# Altium project QUTMS-TSAL.PrjPcb
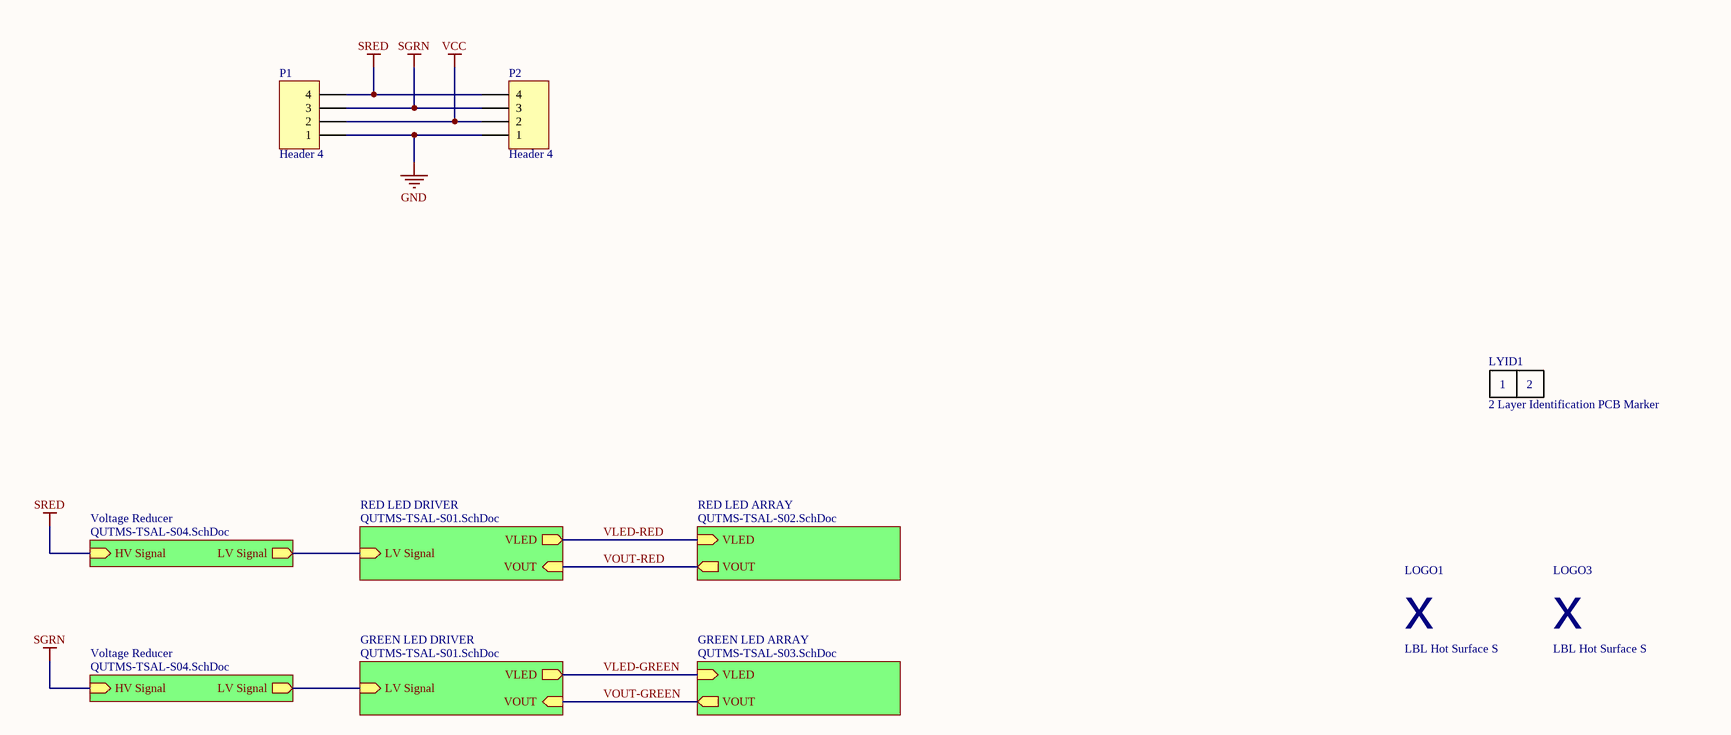
[diagram p0: QUTMS-TSAL-S00.SchDoc]
7 sheets, 35 parts. Net scope: hierarchical (ports join the sheet entries above them; power ports are global).
Board file: QUTMS-TSAL-B00.PcbDoc
Sheets:
  QUTMS-TSAL-S00.SchDoc
    RED LED DRIVER = QUTMS-TSAL-S01.SchDoc
    RED LED ARRAY = QUTMS-TSAL-S02.SchDoc
    GREEN LED ARRAY = QUTMS-TSAL-S03.SchDoc
    GREEN LED DRIVER = QUTMS-TSAL-S01.SchDoc
    Voltage Reducer = QUTMS-TSAL-S04.SchDoc
    Voltage Reducer = QUTMS-TSAL-S04.SchDoc
  QUTMS-TSAL-NEW-S01.SchDoc
  QUTMS-TSAL-NEW-S04.SchDoc

## Sheet QUTMS-TSAL-S00.SchDoc: Tractive System Active Light - TSAL
size A3; DrawnBy: Joseph Richards; DocumentNumber: 1; Revision: 2; SheetNumber: 1; SheetTotal: 5

### Parts
LOGO1  LBL Hot Surface S  [LBL HOT SMALL]
LOGO3  LBL Hot Surface S  [LBL HOT SMALL]
LYID1  2 Layer Identification PCB Marker  [LAYER IDENT 2]
P1  Header 4  [HDR1X4]
P2  Header 4  [HDR1X4]

### Sub-sheets
GREEN LED ARRAY = QUTMS-TSAL-S03.SchDoc: VOUT (out), VLED (in)
GREEN LED DRIVER = QUTMS-TSAL-S01.SchDoc: VLED (out), VOUT (in), LV Signal (in)
RED LED ARRAY = QUTMS-TSAL-S02.SchDoc: VOUT (out), VLED (in)
RED LED DRIVER = QUTMS-TSAL-S01.SchDoc: VLED (out), VOUT (in), LV Signal (in)
Voltage Reducer = QUTMS-TSAL-S04.SchDoc: HV Signal (in), LV Signal (out)
Voltage Reducer = QUTMS-TSAL-S04.SchDoc: HV Signal (in), LV Signal (out)

### Nets
GND: P1.1 P2.1
SGRN: P1.3 P2.3 ; sheet Voltage Reducer/HV Signal
SRED: P1.4 P2.4 ; sheet Voltage Reducer/HV Signal
VCC: P1.2 P2.2
VLED-GREEN: sheet GREEN LED ARRAY/VLED, sheet GREEN LED DRIVER/VLED
VLED-RED: sheet RED LED DRIVER/VLED, sheet RED LED ARRAY/VLED
VOUT-GREEN: sheet GREEN LED ARRAY/VOUT, sheet GREEN LED DRIVER/VOUT
VOUT-RED: sheet RED LED DRIVER/VOUT, sheet RED LED ARRAY/VOUT
NetD2A_K: sheet RED LED DRIVER/LV Signal, sheet Voltage Reducer/LV Signal
NetD2B_K: sheet GREEN LED DRIVER/LV Signal, sheet Voltage Reducer/LV Signal

### Notes on the sheet
- Revision History:
- Sheet Title:
- Rev
- Date
- Description
- Project:
- Size:
- Drawn By:
- A3
- Number:
- Revision:
- Sheet
- Version:
- of
- QUT Motorsport
- O-120, Gardens Point
- 2 George Street
- Brisbane, QLD 4000
- Australia
- Print Date:
- Print Time:
- File Name:
- (in symbol Layer Identification 2) 1; 2
- (in symbol LBL Hot Surface S) x

### Library data of the parts
LYID1 = Layer Identification 2
P1 P2 = Header 4: Header, 4-Pin; LatestRevisionDate: 17-Jul-2002; LatestRevisionNote: Re-released for DXP Platform.; Publisher: Altium Limited

## Sheet QUTMS-TSAL-S01.SchDoc: LED Driver
size A3; DrawnBy: Joseph Richards; DocumentNumber: 2; Revision: 2; SheetNumber: 2; SheetTotal: 5
Used 2 times, as channels RED LED DRIVER, GREEN LED DRIVER. Parts and nets are listed once, with the designators drawn on the sheet.
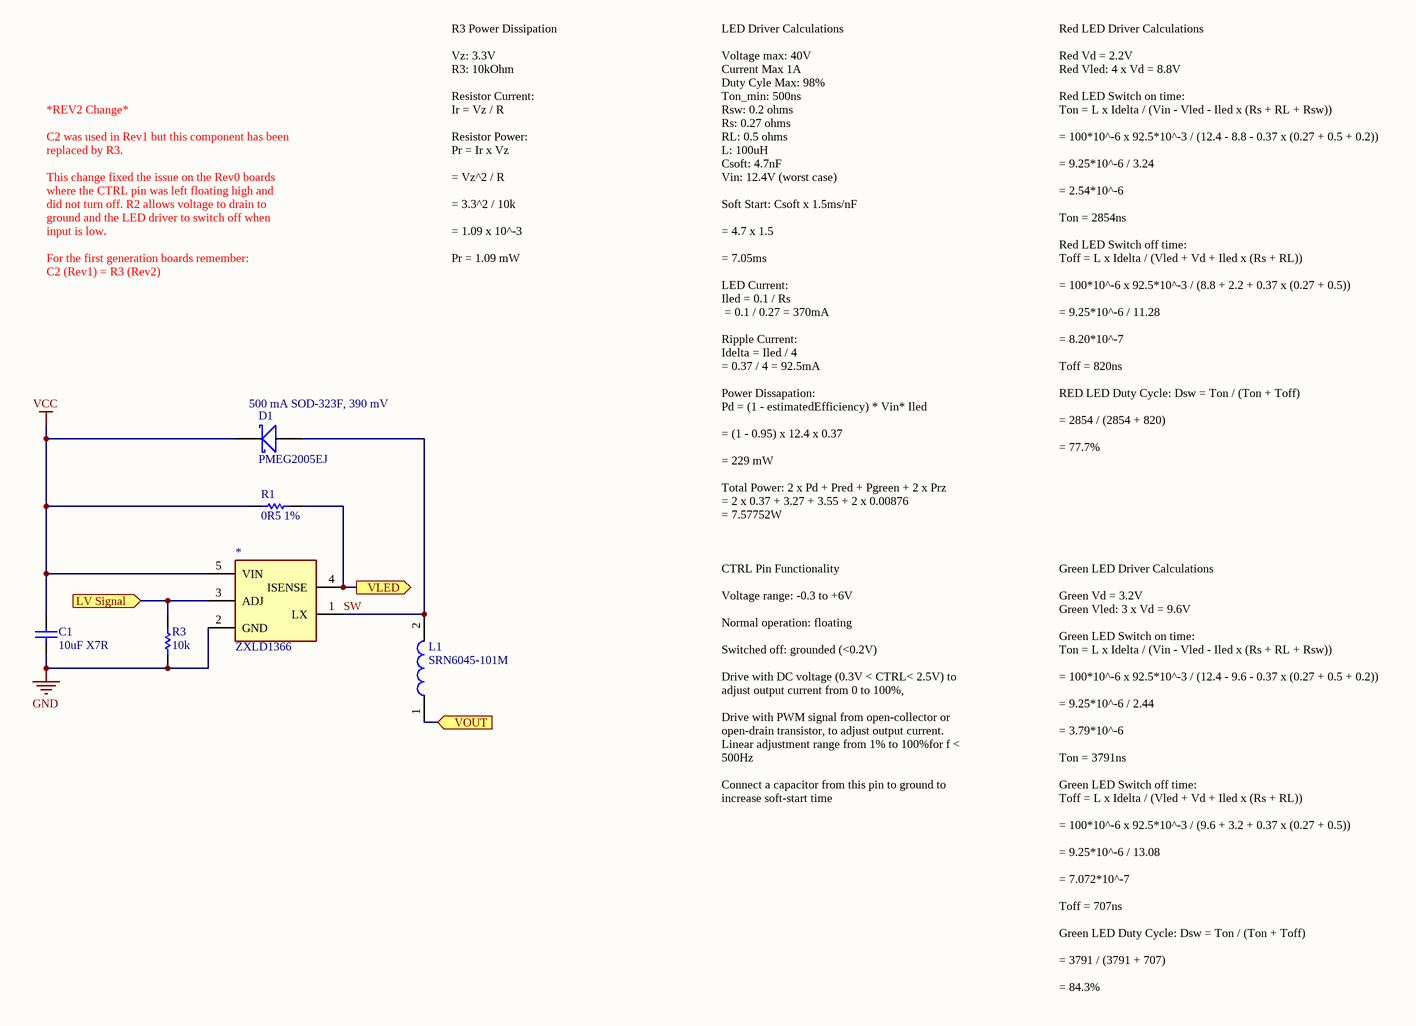
[diagram p1: QUTMS-TSAL-S01.SchDoc]

### Parts
*  ZXLD1366  [SOT95P280X100-5N]
C1  10uF X7R  [Cap_Ceramic_0603]
D1  PMEG2005EJ  [SOD-323F]
L1  SRN6045-101M  [Bourns Inductor 6x6x4.5mm]
R1  0R5 1%  [RESC1005X04N]
R3  10k  [Res_ThinFilm_0603]

### Ports
LV Signal (in), VLED (out), VOUT (in)

### Nets
GND: *.2(GND) C1.1 R3.1
VCC: *.5(VIN) C1.2 D1.K(Cathode) R1.1
LV Signal: *.3(ADJ) R3.2 ; port LV Signal
SW: *.1(LX) D1.A(Anode) L1.2
VLED: *.4(ISENSE) R1.2 ; port VLED
VOUT: L1.1 ; port VOUT

### Channels
RED LED DRIVER: designators *=UB C1=C1B D1=D1B L1=L1B R1=R1B R3=R3B; ports LV Signal=NetD2A_K VLED=VLED-RED VOUT=VOUT-RED
GREEN LED DRIVER: designators *=UA C1=C1A D1=D1A L1=L1A R1=R1A R3=R3A; ports LV Signal=NetD2B_K VLED=VLED-GREEN VOUT=VOUT-GREEN

### Notes on the sheet
- *REV2 Change*
  C2 was used in Rev1 but this component has been replaced by R3.
  This change fixed the issue on the Rev0 boards where the CTRL pin was left floating high and did not turn off. R2 allows voltage to drain to ground and the LED driver to switch off when input is low.
  For the first generation boards remember:
  C2 (Rev1) = R3 (Rev2)
- R3 Power Dissipation
  Vz: 3.3V
  R3: 10kOhm
  Resistor Current:
  Ir = Vz / R
  Resistor Power:
  Pr = Ir x Vz
  = Vz^2 / R
  = 3.3^2 / 10k
  = 1.09 x 10^-3
  Pr = 1.09 mW
- (near D1) 500 mA SOD-323F, 390 mV
- Red LED Driver Calculations
  Red Vd = 2.2V
  Red Vled: 4 x Vd = 8.8V
  Red LED Switch on time:
  Ton = L x Idelta / (Vin - Vled - Iled x (Rs + RL + Rsw))
  = 100*10^-6 x 92.5*10^-3 / (12.4 - 8.8 - 0.37 x (0.27 + 0.5 + 0.2))
  = 9.25*10^-6 / 3.24
  = 2.54*10^-6
  Ton = 2854ns
  Red LED Switch off time:
  Toff = L x Idelta / (Vled + Vd + Iled x (Rs + RL))
  = 100*10^-6 x 92.5*10^-3 / (8.8 + 2.2 + 0.37 x (0.27 + 0.5))
  = 9.25*10^-6 / 11.28
  = 8.20*10^-7
  Toff = 820ns
  RED LED Duty Cycle: Dsw = Ton / (Ton + Toff)
  = 2854 / (2854 + 820)
  = 77.7%
- LED Driver Calculations
  Voltage max: 40V
  Current Max 1A
  Duty Cyle Max: 98%
  Ton_min: 500ns
  Rsw: 0.2 ohms
  Rs: 0.27 ohms
  RL: 0.5 ohms
  L: 100uH
  Csoft: 4.7nF
  Vin: 12.4V (worst case)
  Soft Start: Csoft x 1.5ms/nF
  = 4.7 x 1.5
  = 7.05ms
  LED Current:
  Iled = 0.1 / Rs
  = 0.1 / 0.27 = 370mA
  Ripple Current:
  Idelta = Iled / 4
  = 0.37 / 4 = 92.5mA
  Power Dissapation:
  Pd = (1 - estimatedEfficiency) * Vin* Iled
  = (1 - 0.95) x 12.4 x 0.37
  = 229 mW
  Total Power: 2 x Pd + Pred + Pgreen + 2 x Prz
  = 2 x 0.37 + 3.27 + 3.55 + 2 x 0.00876
  = 7.57752W
- CTRL Pin Functionality
  Voltage range: -0.3 to +6V
  Normal operation: floating
  Switched off: grounded (<0.2V)
  Drive with DC voltage (0.3V < CTRL< 2.5V) to adjust output current from 0 to 100%,
  Drive with PWM signal from open-collector or open-drain transistor, to adjust output current. Linear adjustment range from 1% to 100%for f < 500Hz
  Connect a capacitor from this pin to ground to increase soft-start time
- Green LED Driver Calculations
  Green Vd = 3.2V
  Green Vled: 3 x Vd = 9.6V
  Green LED Switch on time:
  Ton = L x Idelta / (Vin - Vled - Iled x (Rs + RL + Rsw))
  = 100*10^-6 x 92.5*10^-3 / (12.4 - 9.6 - 0.37 x (0.27 + 0.5 + 0.2))
  = 9.25*10^-6 / 2.44
  = 3.79*10^-6
  Ton = 3791ns
  Green LED Switch off time:
  Toff = L x Idelta / (Vled + Vd + Iled x (Rs + RL))
  = 100*10^-6 x 92.5*10^-3 / (9.6 + 3.2 + 0.37 x (0.27 + 0.5))
  = 9.25*10^-6 / 13.08
  = 7.072*10^-7
  Toff = 707ns
  Green LED Duty Cycle: Dsw = Ton / (Ton + Toff)
  = 3791 / (3791 + 707)
  = 84.3%
- Revision History:
- Sheet Title:
- Rev
- Date
- Description
- Project:
- Size:
- Drawn By:
- A3
- Number:
- Revision:
- Sheet
- Version:
- of
- QUT Motorsport
- O-120, Gardens Point
- 2 George Street
- Brisbane, QLD 4000
- Australia
- Print Date:
- Print Time:
- File Name:

### Library data of the parts
* = ZXLD136ET5TA
C1 = 10uF 50V 5% X7R 0603: Capacitor, Ceramic, SMD, 10uF, 50V, 5%, X7R, 0603
D1 = PMEG2005EJ: Diode, Schottky, SMD, 20 V, 500 mA, Single, SOD-323F, 2 Pins, 390 mV; ComponentLink1Description: Element14; ComponentLink1URL: https://au.element14.com/nexperia/pmeg2005ej-115/schottky-rect-20v-0-5a-sod323f/dp/1757760
L1 = SRN6045-101M: Inductor, 100 µH, 700 mA, Semishielded, 800 mA, SRN6045 Series, 6mm x 6mm x 4.5mm; ComponentLink1Description: Element14; ComponentLink1URL: https://au.element14.com/bourns/srn6045-101m/inductor-100uh-semi-shielded-power/dp/2061658
R1 = 0R27 1% 0603: Resistor, SMD, 0R27, 0.1W, 1%, 0603
R3 = 10k 5% 0603: Resistor, SMD, 10k, 0.1W, 5%, 0603

## Sheet QUTMS-TSAL-S02.SchDoc: Red LED Array
size A3; DrawnBy: Joseph Richards; DocumentNumber: 3; Revision: 2; SheetNumber: 3; SheetTotal: 5
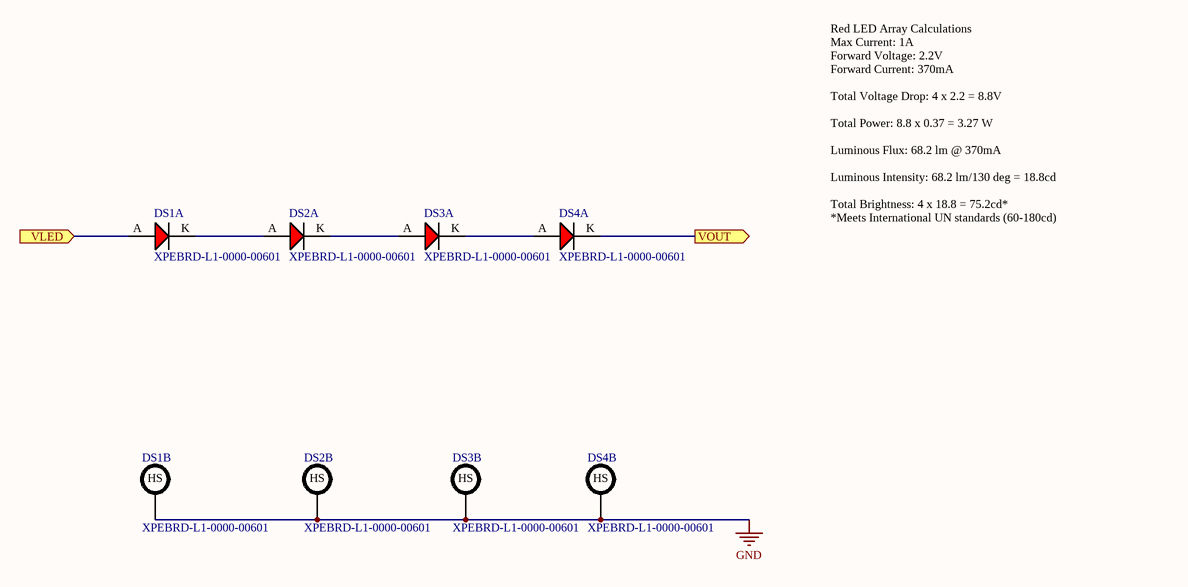
[diagram p2: QUTMS-TSAL-S02.SchDoc]

### Parts
DS1  XPEBRD-L1-0000-00601  [Cree XLamp XP-E2]  (parts A,B of 2)
DS2  XPEBRD-L1-0000-00601  [Cree XLamp XP-E2]  (parts A,B of 2)
DS3  XPEBRD-L1-0000-00601  [Cree XLamp XP-E2]  (parts A,B of 2)
DS4  XPEBRD-L1-0000-00601  [Cree XLamp XP-E2]  (parts A,B of 2)

### Ports
VLED (in), VOUT (out)

### Nets
GND: DS1.HS DS2.HS DS3.HS DS4.HS
VLED-RED: DS1.A ; port VLED
VOUT-RED: DS4.K ; port VOUT
NetDS1_K: DS1.K DS2.A
NetDS2_K: DS2.K DS3.A
NetDS3_K: DS3.K DS4.A

### Notes on the sheet
- Red LED Array Calculations
  Max Current: 1A
  Forward Voltage: 2.2V
  Forward Current: 370mA
  Total Voltage Drop: 4 x 2.2 = 8.8V
  Total Power: 8.8 x 0.37 = 3.27 W
  Luminous Flux: 68.2 lm @ 370mA
  Luminous Intensity: 68.2 lm/130 deg = 18.8cd
  Total Brightness: 4 x 18.8 = 75.2cd*
  *Meets International UN standards (60-180cd)
- Revision History:
- Sheet Title:
- Rev
- Date
- Description
- Project:
- Size:
- Drawn By:
- A3
- Number:
- Revision:
- Sheet
- Version:
- of
- QUT Motorsport
- O-120, Gardens Point
- 2 George Street
- Brisbane, QLD 4000
- Australia
- Print Date:
- Print Time:
- File Name:

### Library data of the parts
DS1-DS4 = XPEBRD-L1-0000-00601: LED, Cree XLamp XP-E2 Series, Red, 630 nm, 130 °, 62 lm, 1 A; ComponentLink1Description: Element14; ComponentLink1URL: https://au.element14.com/cree/xpebrd-l1-0000-00601/led-smd-xlamp-xpe-e-red-62lm/dp/2335107

## Sheet QUTMS-TSAL-S03.SchDoc: Green LED Array
size A3; DrawnBy: Joseph Richards; DocumentNumber: 4; Revision: 2; SheetNumber: 4; SheetTotal: 5
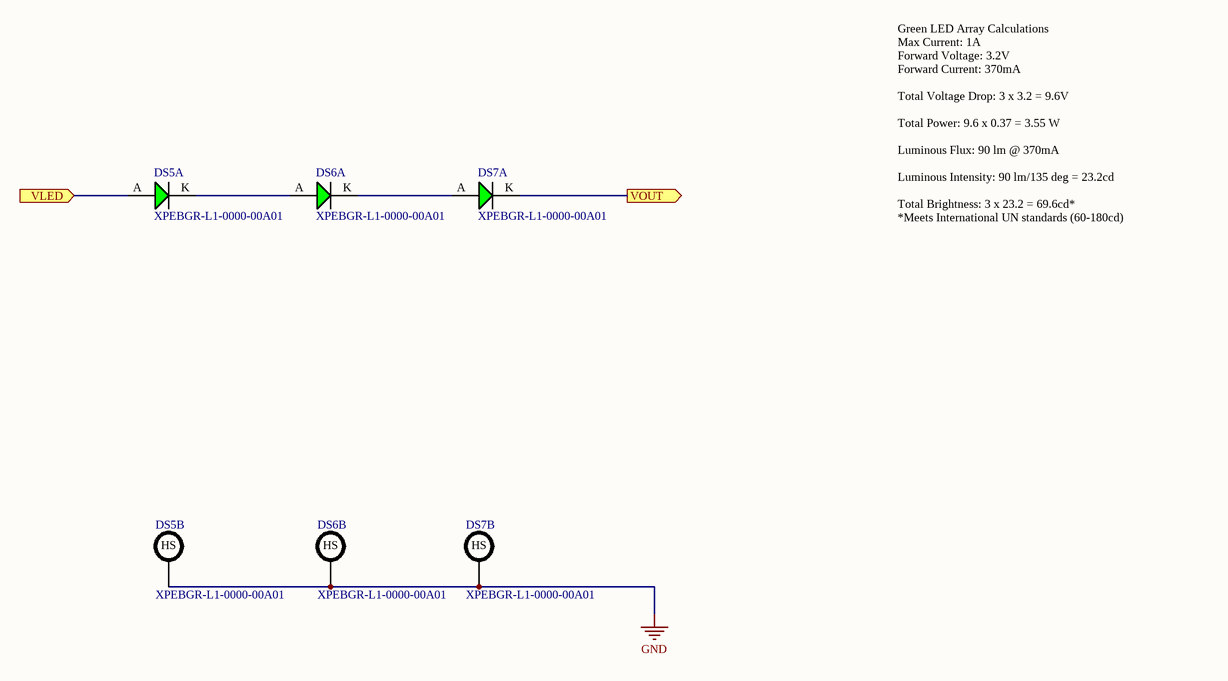
[diagram p3: QUTMS-TSAL-S03.SchDoc]

### Parts
DS5  XPEBGR-L1-0000-00A01  [Cree XLamp XP-E2]  (parts A,B of 2)
DS6  XPEBGR-L1-0000-00A01  [Cree XLamp XP-E2]  (parts A,B of 2)
DS7  XPEBGR-L1-0000-00A01  [Cree XLamp XP-E2]  (parts A,B of 2)

### Ports
VLED (in), VOUT (out)

### Nets
GND: DS5.HS DS6.HS DS7.HS
VLED-GREEN: DS5.A ; port VLED
VOUT-GREEN: DS7.K ; port VOUT
NetDS5_K: DS5.K DS6.A
NetDS6_K: DS6.K DS7.A

### Notes on the sheet
- Green LED Array Calculations
  Max Current: 1A
  Forward Voltage: 3.2V
  Forward Current: 370mA
  Total Voltage Drop: 3 x 3.2 = 9.6V
  Total Power: 9.6 x 0.37 = 3.55 W
  Luminous Flux: 90 lm @ 370mA
  Luminous Intensity: 90 lm/135 deg = 23.2cd
  Total Brightness: 3 x 23.2 = 69.6cd*
  *Meets International UN standards (60-180cd)
- Revision History:
- Sheet Title:
- Rev
- Date
- Description
- Project:
- Size:
- Drawn By:
- A3
- Number:
- Revision:
- Sheet
- Version:
- of
- QUT Motorsport
- O-120, Gardens Point
- 2 George Street
- Brisbane, QLD 4000
- Australia
- Print Date:
- Print Time:
- File Name:

### Library data of the parts
DS5-DS7 = XPEBGR-L1-0000-00A01: LED, Cree XLamp XP-E2 Series, Green, 535 nm, 135 °, 87.4 lm, 1 A; ComponentLink1Description: Element14; ComponentLink1URL: https://au.element14.com/cree/xpebrd-l1-0000-00601/led-smd-xlamp-xpe-e-red-62lm/dp/2335107

## Sheet QUTMS-TSAL-S04.SchDoc: Zener Voltage Regulator
size A3; DrawnBy: Joseph Richards; DocumentNumber: 5; Revision: 2; SheetNumber: 5; SheetTotal: 5
Used 2 times, as channels Voltage Reducer, Voltage Reducer. Parts and nets are listed once, with the designators drawn on the sheet.
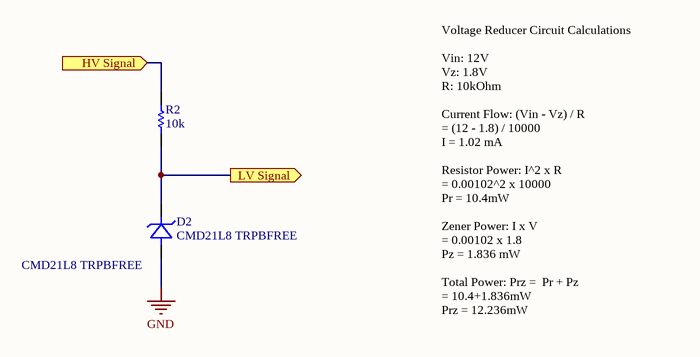
[diagram p4: QUTMS-TSAL-S04.SchDoc]

### Parts
D2  CMD21L8 TRPBFREE  [SODFL160X80-2N]
R2  10k  [Res_ThinFilm_0603]

### Ports
HV Signal (in), LV Signal (out)

### Nets
GND: D2.A(Anode)
HV Signal: R2.2 ; port HV Signal
LV Signal: D2.K(Cathode) R2.1 ; port LV Signal

### Channels
Voltage Reducer: designators end in A; ports HV Signal=SRED LV Signal=NetD2A_K
Voltage Reducer: designators end in B; ports HV Signal=SGRN LV Signal=NetD2B_K

### Notes on the sheet
- (near D2) CMD21L8 TRPBFREE
- Voltage Reducer Circuit Calculations
  Vin: 12V
  Vz: 1.8V
  R: 10kOhm
  Current Flow: (Vin - Vz) / R
  = (12 - 1.8) / 10000
  I = 1.02 mA
  Resistor Power: I^2 x R
  = 0.00102^2 x 10000
  Pr = 10.4mW
  Zener Power: I x V
  = 0.00102 x 1.8
  Pz = 1.836 mW
  Total Power: Prz =  Pr + Pz
  = 10.4+1.836mW
  Prz = 12.236mW
- Revision History:
- Sheet Title:
- Rev
- Date
- Description
- Project:
- Size:
- Drawn By:
- A3
- Number:
- Revision:
- Sheet
- Version:
- of
- QUT Motorsport
- O-120, Gardens Point
- 2 George Street
- Brisbane, QLD 4000
- Australia
- Print Date:
- Print Time:
- File Name:

### Library data of the parts
R2 = 10k 5% 0603: Resistor, SMD, 10k, 0.1W, 5%, 0603

## Sheet QUTMS-TSAL-NEW-S01.SchDoc: LED Driver
size A3; DrawnBy: Joseph Richards; DocumentNumber: 2; Revision: 2; SheetNumber: 2; SheetTotal: 5
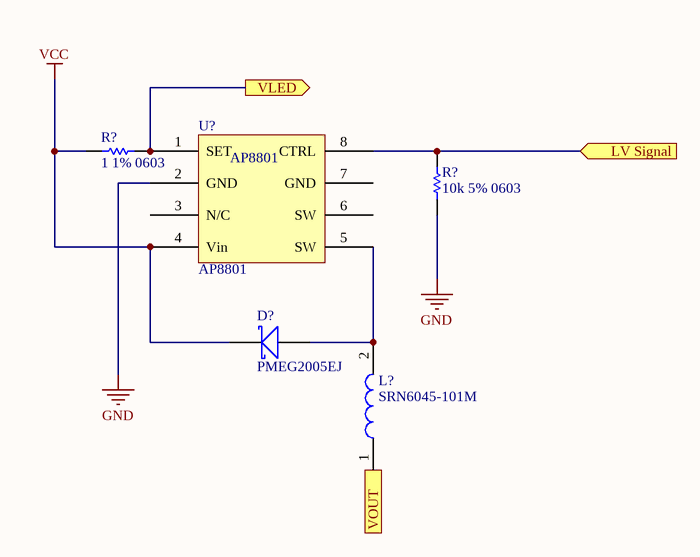
[diagram p5: QUTMS-TSAL-NEW-S01.SchDoc]

### Parts
(Parts that share a designator on the sheet are numbered #1, #2 ... from top to bottom, then left to right.)
D?  PMEG2005EJ  [SOD-323F(shottkey)]
L?  SRN6045-101M  [Bourns Inductor 6x6x4.5mm(100mH)]
R?#1  1 1% 0603  [Res_ThinFilm_0603 (1,10k)]
R?#2  10k 5% 0603  [Res_ThinFilm_0603 (1,10k)]
U?  AP8801  [SOP8/SO8(AP8801)]

### Ports
LV Signal (in), VLED (out), VOUT (in)

### Nets
GND: R?#2.1 U?.2(GND)
VCC: D?.K(Cathode) R?#1.1 U?.4(Vin)
NetD?_A: D?.A(Anode) L?.2 U?.5(SW)
NetL?_1: L?.1 ; port VOUT
NetR?#1_2: R?#1.2 U?.1(SET) ; port VLED
NetR?#2_2: R?#2.2 U?.8(CTRL) ; port LV Signal

Not connected (* = marked no-connect by the designer): U? 3(N/C) 6(SW) 7(GND)

### Notes on the sheet
- Revision History:
- Sheet Title:
- Rev
- Date
- Description
- Project:
- Size:
- Drawn By:
- A3
- Number:
- Revision:
- Sheet
- Version:
- of
- QUT Motorsport
- O-120, Gardens Point
- 2 George Street
- Brisbane, QLD 4000
- Australia
- Print Date:
- Print Time:
- File Name:

### Library data of the parts
D? = PMEG2005EJ: as D1 on sheet QUTMS-TSAL-S01; ComponentLink1Description: Element14; ComponentLink1URL: https://au.element14.com/nexperia/pmeg2005ej-115/schottky-rect-20v-0-5a-sod323f/dp/1757760
L? = SRN6045-101M: as L1 on sheet QUTMS-TSAL-S01; ComponentLink1Description: Element14; ComponentLink1URL: https://au.element14.com/bourns/srn6045-101m/inductor-100uh-semi-shielded-power/dp/2061658
R?#1 = 1 1% 0603: Resistor, SMD, 1, 0.1W, 1%, 0603
R?#2 = 10k 5% 0603: Resistor, SMD, 10k, 0.1W, 5%, 0603
U? = AP8801: the LED drver fotr the red and green LED's

## Sheet QUTMS-TSAL-NEW-S04.SchDoc: Zener Voltage Regulator
size A3; DrawnBy: Joseph Richards; DocumentNumber: 5; Revision: 2; SheetNumber: 5; SheetTotal: 5
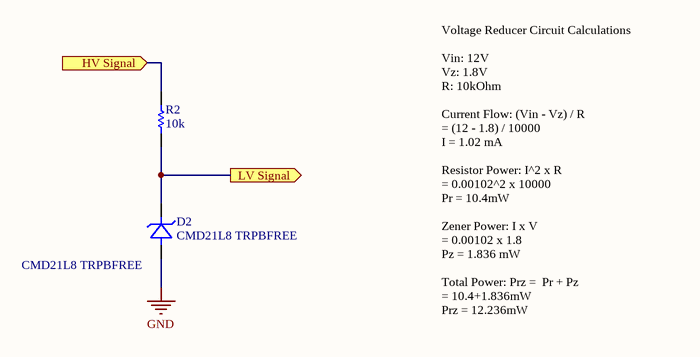
[diagram p6: QUTMS-TSAL-NEW-S04.SchDoc]

### Parts
D2  CMD21L8 TRPBFREE  [SODFL160X80-2N]
R2  10k  [Res_ThinFilm_0603]

### Ports
HV Signal (in), LV Signal (out)

### Nets
GND: D2.A(Anode)
NetD2_K: D2.K(Cathode) R2.1 ; port LV Signal
NetR2_2: R2.2 ; port HV Signal

### Notes on the sheet
- (near D2) CMD21L8 TRPBFREE
- Voltage Reducer Circuit Calculations
  Vin: 12V
  Vz: 1.8V
  R: 10kOhm
  Current Flow: (Vin - Vz) / R
  = (12 - 1.8) / 10000
  I = 1.02 mA
  Resistor Power: I^2 x R
  = 0.00102^2 x 10000
  Pr = 10.4mW
  Zener Power: I x V
  = 0.00102 x 1.8
  Pz = 1.836 mW
  Total Power: Prz =  Pr + Pz
  = 10.4+1.836mW
  Prz = 12.236mW
- Revision History:
- Sheet Title:
- Rev
- Date
- Description
- Project:
- Size:
- Drawn By:
- A3
- Number:
- Revision:
- Sheet
- Version:
- of
- QUT Motorsport
- O-120, Gardens Point
- 2 George Street
- Brisbane, QLD 4000
- Australia
- Print Date:
- Print Time:
- File Name:

### Library data of the parts
R2 = 10k 5% 0603: Resistor, SMD, 10k, 0.1W, 5%, 0603

## Nets that join several sheets
GND: QUTMS-TSAL-S00 (P1.1 P2.1), RED LED DRIVER (C1B.1 R3B.1 UB.2), QUTMS-TSAL-S02 (DS1.HS DS2.HS DS3.HS DS4.HS), QUTMS-TSAL-S03 (DS5.HS DS6.HS DS7.HS), GREEN LED DRIVER (C1A.1 R3A.1 UA.2), Voltage Reducer (D2A.A), Voltage Reducer (D2B.A), QUTMS-TSAL-NEW-S01 (R?#2.1 U?.2), QUTMS-TSAL-NEW-S04 (D2.A)
SGRN: QUTMS-TSAL-S00 (P1.3 P2.3), Voltage Reducer (R2B.2)
SRED: QUTMS-TSAL-S00 (P1.4 P2.4), Voltage Reducer (R2A.2)
VCC: QUTMS-TSAL-S00 (P1.2 P2.2), RED LED DRIVER (C1B.2 D1B.K R1B.1 UB.5), GREEN LED DRIVER (C1A.2 D1A.K R1A.1 UA.5), QUTMS-TSAL-NEW-S01 (D?.K R?#1.1 U?.4)
NetD2A_K: RED LED DRIVER (R3B.2 UB.3), Voltage Reducer (D2A.K R2A.1)
NetD2B_K: GREEN LED DRIVER (R3A.2 UA.3), Voltage Reducer (D2B.K R2B.1)
VLED-GREEN: QUTMS-TSAL-S03 (DS5.A), GREEN LED DRIVER (R1A.2 UA.4)
VLED-RED: RED LED DRIVER (R1B.2 UB.4), QUTMS-TSAL-S02 (DS1.A)
VOUT-GREEN: QUTMS-TSAL-S03 (DS7.K), GREEN LED DRIVER (L1A.1)
VOUT-RED: RED LED DRIVER (L1B.1), QUTMS-TSAL-S02 (DS4.K)